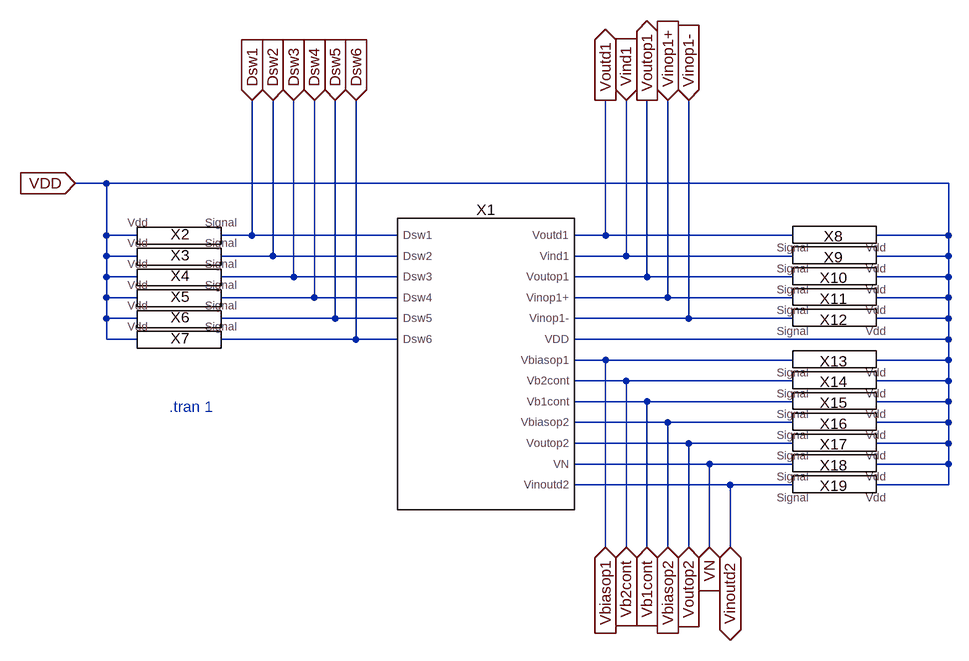
[diagram p0: schematic effectortopESDnew.asc]
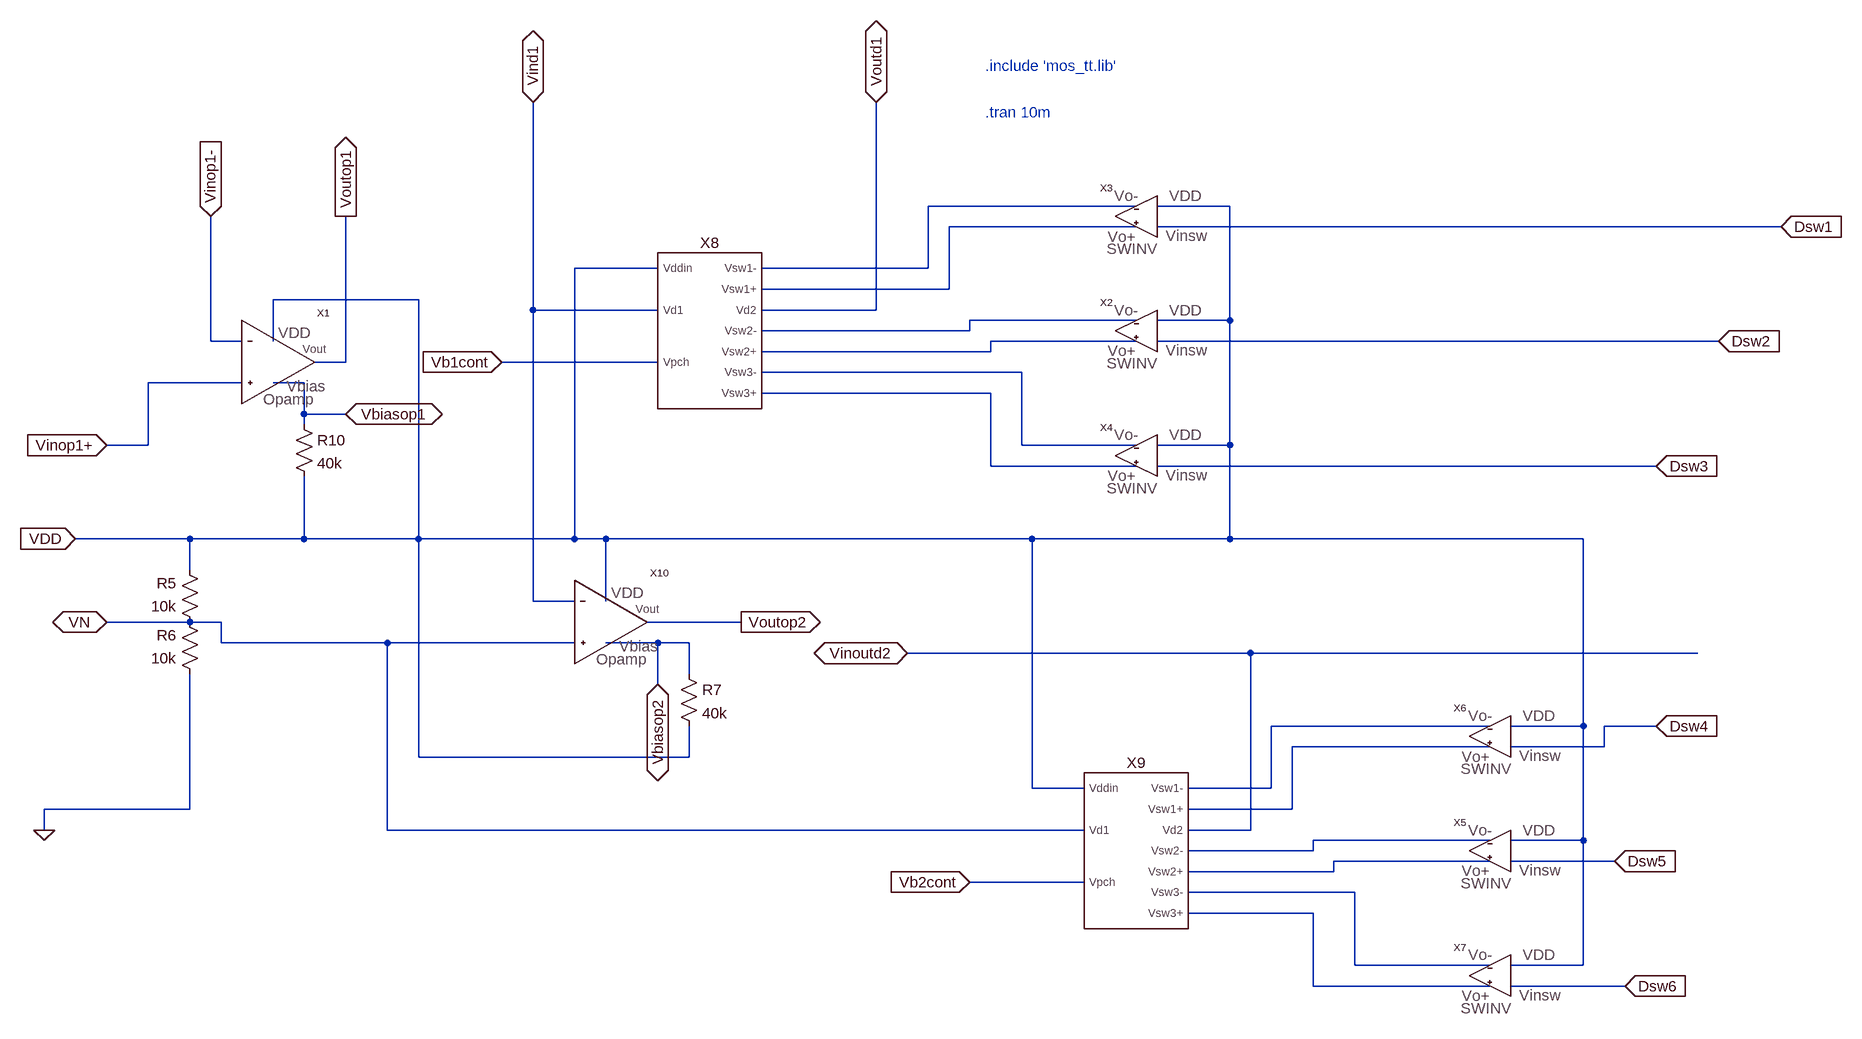
[diagram p1: sub-circuit effectornew.asc]
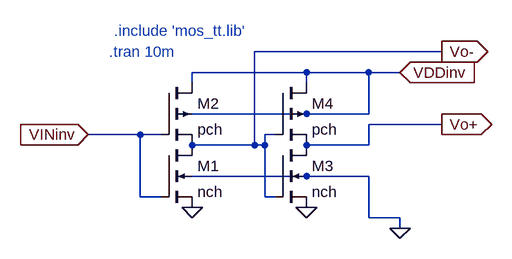
[diagram p2: sub-circuit invsw.asc]
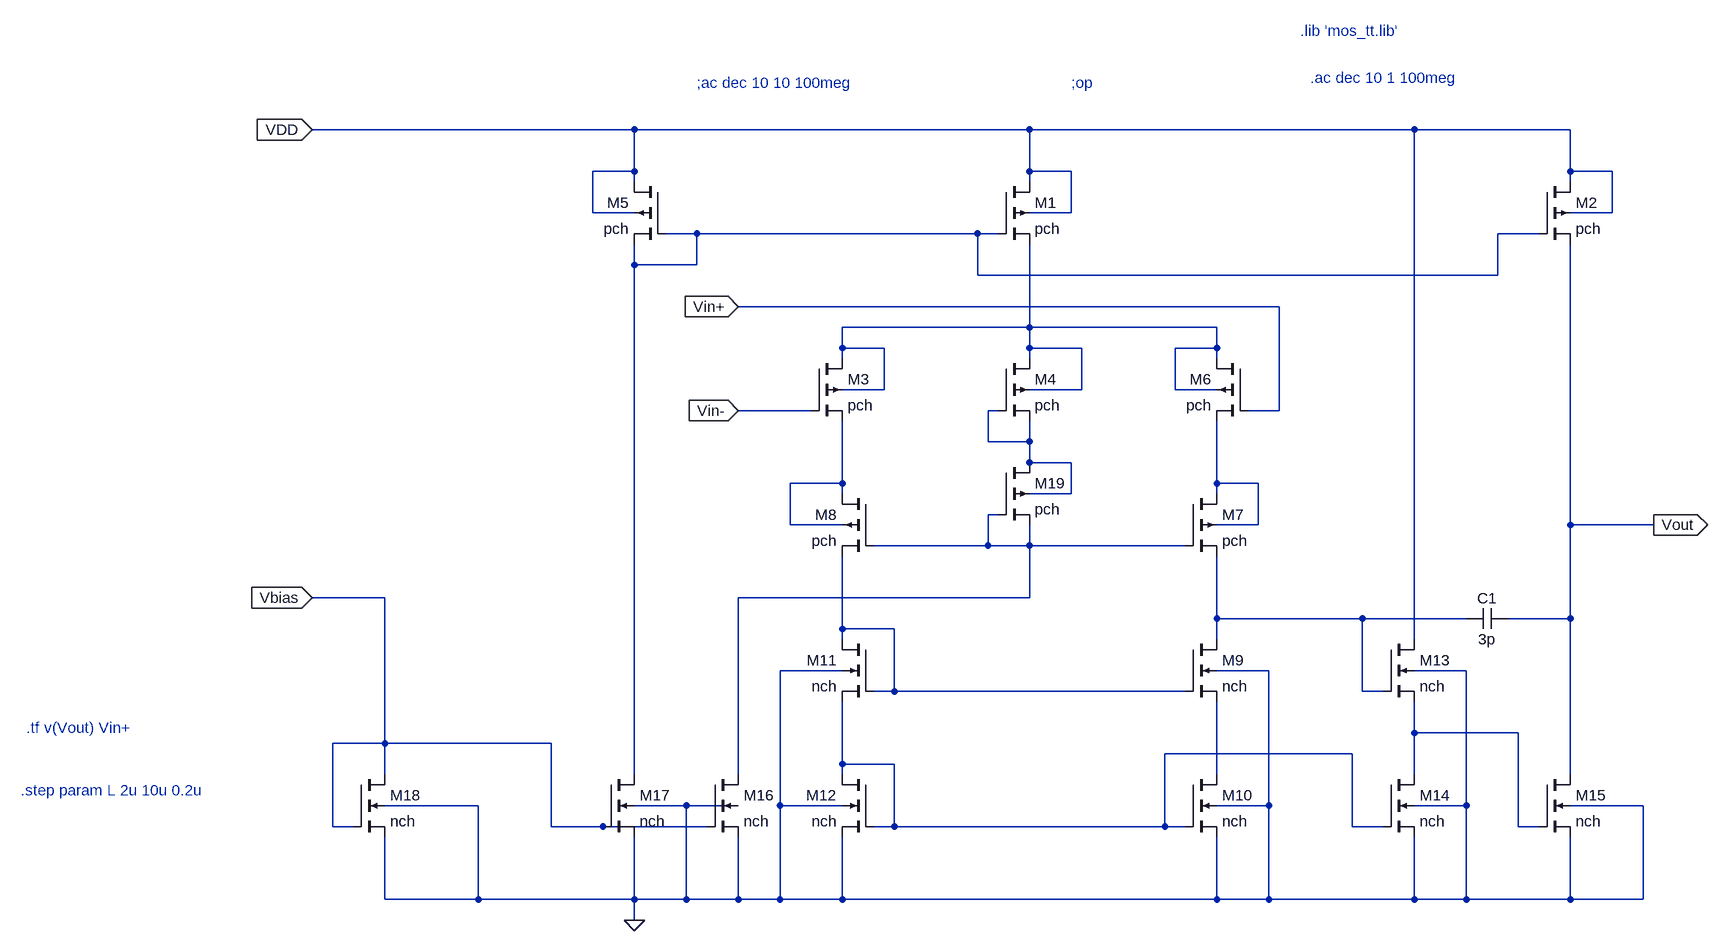
[diagram p3: sub-circuit opamp3u.asc]
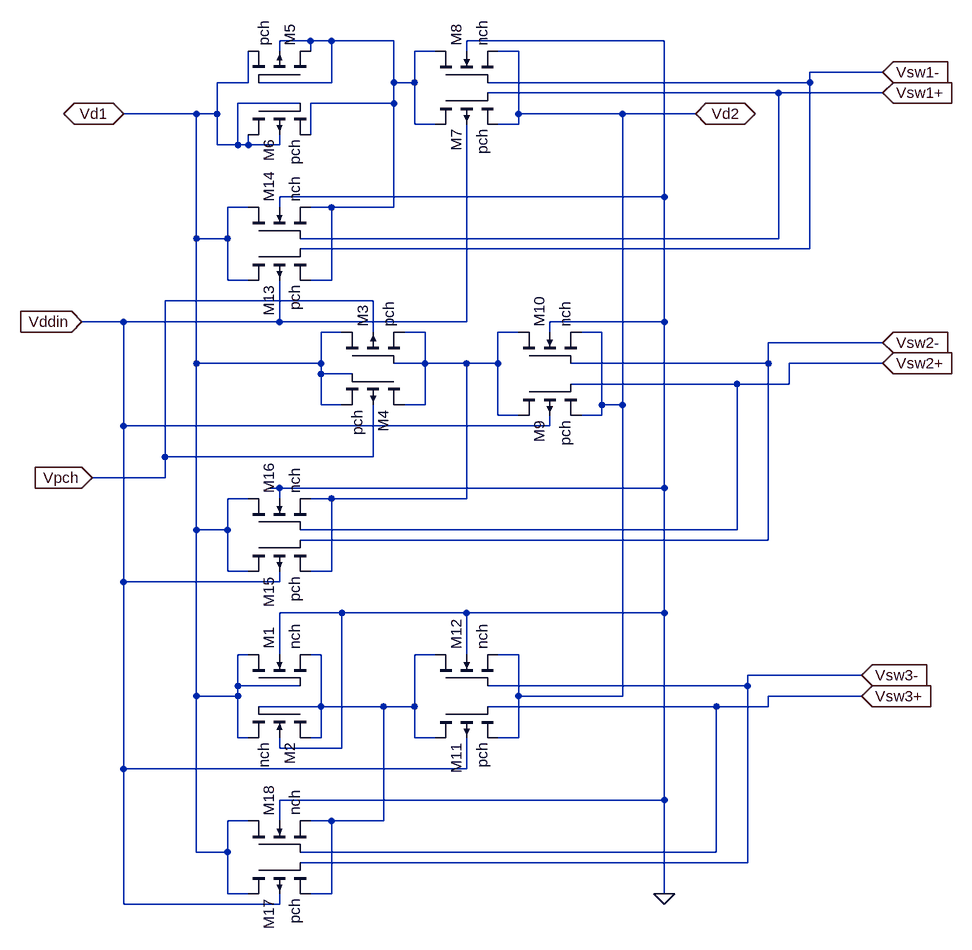
[diagram p4: sub-circuit distotiondevice1esdpchnew.asc]
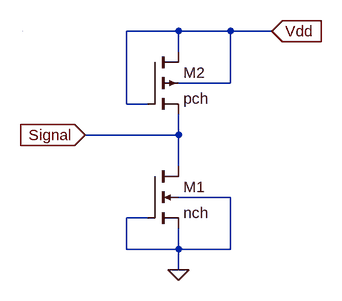
[diagram p5: sub-circuit esd.asc]
effectortopESDnew.asc, the LTspice schematic file:
Version 4
SHEET 1 920 756
WIRE -480 16 -528 16
WIRE 816 16 -480 16
WIRE -480 96 -480 16
WIRE -432 96 -480 96
WIRE -256 96 -256 -112
WIRE -256 96 -304 96
WIRE -32 96 -256 96
WIRE 288 96 288 -112
WIRE 288 96 240 96
WIRE 576 96 288 96
WIRE 816 96 816 16
WIRE 816 96 704 96
WIRE -480 128 -480 96
WIRE -432 128 -480 128
WIRE -224 128 -224 -112
WIRE -224 128 -304 128
WIRE -32 128 -224 128
WIRE 320 128 320 -112
WIRE 320 128 240 128
WIRE 576 128 320 128
WIRE 816 128 816 96
WIRE 816 128 704 128
WIRE -480 160 -480 128
WIRE -432 160 -480 160
WIRE -192 160 -192 -112
WIRE -192 160 -304 160
WIRE -32 160 -192 160
WIRE 352 160 352 -112
WIRE 352 160 240 160
WIRE 576 160 352 160
WIRE 816 160 816 128
WIRE 816 160 704 160
WIRE -480 192 -480 160
WIRE -432 192 -480 192
WIRE -160 192 -160 -112
WIRE -160 192 -304 192
WIRE -32 192 -160 192
WIRE 384 192 384 -112
WIRE 384 192 240 192
WIRE 576 192 384 192
WIRE 816 192 816 160
WIRE 816 192 704 192
WIRE -480 224 -480 192
WIRE -432 224 -480 224
WIRE -128 224 -128 -112
WIRE -128 224 -304 224
WIRE -32 224 -128 224
WIRE 416 224 416 -112
WIRE 416 224 240 224
WIRE 576 224 416 224
WIRE 816 224 816 192
WIRE 816 224 704 224
WIRE -480 256 -480 224
WIRE -432 256 -480 256
WIRE -96 256 -96 -112
WIRE -96 256 -304 256
WIRE -32 256 -96 256
WIRE 816 256 816 224
WIRE 816 256 240 256
WIRE 288 288 240 288
WIRE 576 288 288 288
WIRE 816 288 816 256
WIRE 816 288 704 288
WIRE 320 320 240 320
WIRE 576 320 320 320
WIRE 816 320 816 288
WIRE 816 320 704 320
WIRE 352 352 240 352
WIRE 576 352 352 352
WIRE 816 352 816 320
WIRE 816 352 704 352
WIRE 384 384 240 384
WIRE 576 384 384 384
WIRE 816 384 816 352
WIRE 816 384 704 384
WIRE 416 416 240 416
WIRE 576 416 416 416
WIRE 816 416 816 384
WIRE 816 416 704 416
WIRE 448 448 240 448
WIRE 576 448 448 448
WIRE 816 448 816 416
WIRE 816 448 704 448
WIRE 480 480 240 480
WIRE 576 480 480 480
WIRE 816 480 816 448
WIRE 816 480 704 480
WIRE 288 576 288 288
WIRE 320 576 320 320
WIRE 352 576 352 352
WIRE 384 576 384 384
WIRE 416 576 416 416
WIRE 448 576 448 448
WIRE 480 576 480 480
FLAG -528 16 VDD
IOPIN -528 16 In
FLAG -256 -112 Dsw1
IOPIN -256 -112 In
FLAG -224 -112 Dsw2
IOPIN -224 -112 In
FLAG -192 -112 Dsw3
IOPIN -192 -112 In
FLAG -160 -112 Dsw4
IOPIN -160 -112 In
FLAG -128 -112 Dsw5
IOPIN -128 -112 In
FLAG -96 -112 Dsw6
IOPIN -96 -112 In
FLAG 288 -112 Voutd1
IOPIN 288 -112 Out
FLAG 320 -112 Vind1
IOPIN 320 -112 In
FLAG 352 -112 Voutop1
IOPIN 352 -112 Out
FLAG 384 -112 Vinop1+
IOPIN 384 -112 In
FLAG 416 -112 Vinop1-
IOPIN 416 -112 In
FLAG 288 576 Vbiasop1
IOPIN 288 576 In
FLAG 320 576 Vb2cont
IOPIN 320 576 In
FLAG 384 576 Vbiasop2
IOPIN 384 576 In
FLAG 416 576 Voutop2
IOPIN 416 576 In
FLAG 448 576 VN
IOPIN 448 576 In
FLAG 352 576 Vb1cont
IOPIN 352 576 In
FLAG 480 576 Vinoutd2
IOPIN 480 576 BiDir
SYMBOL effectornew 96 256 R0
SYMATTR InstName X1
SYMBOL ESD -368 96 R0
SYMATTR InstName X2
SYMBOL ESD -368 128 R0
SYMATTR InstName X3
SYMBOL ESD -368 160 R0
SYMATTR InstName X4
SYMBOL ESD -368 192 R0
SYMATTR InstName X5
SYMBOL ESD -368 224 R0
SYMATTR InstName X6
SYMBOL ESD -368 256 R0
SYMATTR InstName X7
SYMBOL ESD 640 96 R180
SYMATTR InstName X8
SYMBOL ESD 640 128 R180
SYMATTR InstName X9
SYMBOL ESD 640 160 R180
SYMATTR InstName X10
SYMBOL ESD 640 192 R180
SYMATTR InstName X11
SYMBOL ESD 640 224 R180
SYMATTR InstName X12
SYMBOL ESD 640 288 R180
SYMATTR InstName X13
SYMBOL ESD 640 320 R180
SYMATTR InstName X14
SYMBOL ESD 640 352 R180
SYMATTR InstName X15
SYMBOL ESD 640 384 R180
SYMATTR InstName X16
SYMBOL ESD 640 416 R180
SYMATTR InstName X17
SYMBOL ESD 640 448 R180
SYMATTR InstName X18
SYMBOL ESD 640 480 R180
SYMATTR InstName X19
TEXT -384 360 Left 2 ;.tran 1

effectornew.asc, the sub-circuit schematic file:
Version 4
SHEET 1 2252 1512
WIRE 1024 128 704 128
WIRE 1168 128 1056 128
WIRE 1024 160 736 160
WIRE 2016 160 1056 160
WIRE 288 224 160 224
WIRE 704 224 704 128
WIRE 704 224 448 224
WIRE 736 256 736 160
WIRE 736 256 448 256
WIRE -80 272 -304 272
WIRE 96 288 96 -32
WIRE 288 288 96 288
WIRE 624 288 624 -32
WIRE 624 288 448 288
WIRE 1024 304 768 304
WIRE 1168 304 1168 128
WIRE 1168 304 1056 304
WIRE 768 320 768 304
WIRE 768 320 448 320
WIRE -400 336 -400 144
WIRE -352 336 -400 336
WIRE -304 336 -304 272
WIRE 1024 336 800 336
WIRE 1920 336 1056 336
WIRE 800 352 800 336
WIRE 800 352 448 352
WIRE -192 368 -192 144
WIRE -192 368 -240 368
WIRE 288 368 48 368
WIRE 848 384 448 384
WIRE -352 400 -496 400
WIRE -256 400 -304 400
WIRE 800 416 448 416
WIRE -256 448 -256 400
WIRE -192 448 -256 448
WIRE -256 464 -256 448
WIRE -496 496 -496 400
WIRE -496 496 -560 496
WIRE 848 496 848 384
WIRE 1024 496 848 496
WIRE 1168 496 1168 304
WIRE 1168 496 1056 496
WIRE 800 528 800 416
WIRE 1024 528 800 528
WIRE 1824 528 1056 528
WIRE -432 640 -608 640
WIRE -256 640 -256 544
WIRE -256 640 -432 640
WIRE -80 640 -80 272
WIRE -80 640 -256 640
WIRE 160 640 160 224
WIRE 160 640 -80 640
WIRE 208 640 160 640
WIRE 864 640 208 640
WIRE 1168 640 1168 496
WIRE 1168 640 864 640
WIRE 1712 640 1168 640
WIRE -432 688 -432 640
WIRE 96 736 96 288
WIRE 160 736 96 736
WIRE 208 736 208 640
WIRE -432 768 -560 768
WIRE -384 768 -432 768
WIRE 416 768 272 768
WIRE -384 800 -384 768
WIRE -128 800 -384 800
WIRE 160 800 -128 800
WIRE 288 800 208 800
WIRE 336 800 288 800
WIRE 1200 816 672 816
WIRE 1888 816 1200 816
WIRE 336 848 336 800
WIRE 288 864 288 800
WIRE 1568 928 1232 928
WIRE 1712 928 1712 640
WIRE 1712 928 1600 928
WIRE 1824 928 1744 928
WIRE 1568 960 1264 960
WIRE 1744 960 1744 928
WIRE 1744 960 1600 960
WIRE -80 976 -80 640
WIRE 336 976 336 928
WIRE 336 976 -80 976
WIRE 864 1024 864 640
WIRE 944 1024 864 1024
WIRE 1232 1024 1232 928
WIRE 1232 1024 1104 1024
WIRE -432 1056 -432 848
WIRE -432 1056 -656 1056
WIRE 1264 1056 1264 960
WIRE 1264 1056 1104 1056
WIRE -656 1088 -656 1056
WIRE -128 1088 -128 800
WIRE 944 1088 -128 1088
WIRE 1200 1088 1200 816
WIRE 1200 1088 1104 1088
WIRE 1568 1104 1296 1104
WIRE 1712 1104 1712 928
WIRE 1712 1104 1600 1104
WIRE 1296 1120 1296 1104
WIRE 1296 1120 1104 1120
WIRE 1568 1136 1328 1136
WIRE 1760 1136 1600 1136
WIRE 1328 1152 1328 1136
WIRE 1328 1152 1104 1152
WIRE 944 1168 768 1168
WIRE 1360 1184 1104 1184
WIRE 1296 1216 1104 1216
WIRE 1360 1296 1360 1184
WIRE 1568 1296 1360 1296
WIRE 1712 1296 1712 1104
WIRE 1712 1296 1600 1296
WIRE 1296 1328 1296 1216
WIRE 1568 1328 1296 1328
WIRE 1776 1328 1600 1328
FLAG -656 1088 0
FLAG -560 768 VN
IOPIN -560 768 BiDir
FLAG 288 864 Vbiasop2
IOPIN 288 864 BiDir
FLAG 672 816 Vinoutd2
IOPIN 672 816 BiDir
FLAG 1776 1328 Dsw6
IOPIN 1776 1328 In
FLAG 1760 1136 Dsw5
IOPIN 1760 1136 In
FLAG 1824 928 Dsw4
IOPIN 1824 928 In
FLAG 1824 528 Dsw3
IOPIN 1824 528 In
FLAG 1920 336 Dsw2
IOPIN 1920 336 In
FLAG 2016 160 Dsw1
IOPIN 2016 160 In
FLAG 416 768 Voutop2
IOPIN 416 768 Out
FLAG 624 -32 Voutd1
IOPIN 624 -32 BiDir
FLAG 96 -32 Vind1
IOPIN 96 -32 BiDir
FLAG 768 1168 Vb2cont
IOPIN 768 1168 In
FLAG 48 368 Vb1cont
IOPIN 48 368 In
FLAG -192 144 Voutop1
IOPIN -192 144 Out
FLAG -192 448 Vbiasop1
IOPIN -192 448 BiDir
FLAG -560 496 Vinop1+
IOPIN -560 496 In
FLAG -608 640 VDD
IOPIN -608 640 In
FLAG -400 144 Vinop1-
IOPIN -400 144 In
SYMBOL res -416 784 R180
WINDOW 0 36 76 Left 2
WINDOW 3 36 40 Left 2
SYMATTR InstName R5
SYMATTR Value 10k
SYMBOL res -416 864 R180
WINDOW 0 36 76 Left 2
WINDOW 3 36 40 Left 2
SYMATTR InstName R6
SYMATTR Value 10k
SYMBOL INVSW 1024 320 M0
SYMATTR InstName X2
SYMBOL INVSW 1024 144 M0
SYMATTR InstName X3
SYMBOL INVSW 1024 512 M0
SYMATTR InstName X4
SYMBOL res 320 832 R0
SYMATTR InstName R7
SYMATTR Value 40k
SYMBOL INVSW 1568 1120 M0
SYMATTR InstName X5
SYMBOL INVSW 1568 944 M0
SYMATTR InstName X6
SYMBOL INVSW 1568 1312 M0
SYMATTR InstName X7
SYMBOL res -272 448 R0
SYMATTR InstName R10
SYMATTR Value 40k
SYMBOL Opamp3u -272 368 R0
SYMATTR InstName X1
SYMBOL Opamp3u 240 768 R0
SYMATTR InstName X10
SYMBOL Distotiondevice1ESDpchnew 368 320 R0
SYMATTR InstName X8
SYMBOL Distotiondevice1ESDpchnew 1024 1120 R0
SYMATTR InstName X9
TEXT 792 -16 Left 2 ;.tran 10m
TEXT 792 -88 Left 2 ;.include 'mos_tt.lib'

invsw.asc, the sub-circuit schematic file:
Version 4
SHEET 1 880 680
WIRE 544 32 256 32
WIRE 336 64 160 64
WIRE 432 64 336 64
WIRE 480 64 432 64
WIRE 160 80 160 64
WIRE 336 80 336 64
WIRE 336 128 160 128
WIRE 432 128 432 64
WIRE 432 128 336 128
WIRE 544 144 432 144
WIRE 80 160 0 160
WIRE 112 160 80 160
WIRE 288 160 272 160
WIRE 256 176 256 32
WIRE 256 176 160 176
WIRE 272 176 272 160
WIRE 272 176 256 176
WIRE 432 176 432 144
WIRE 432 176 336 176
WIRE 336 224 160 224
WIRE 432 224 336 224
WIRE 80 256 80 160
WIRE 112 256 80 256
WIRE 272 256 272 176
WIRE 288 256 272 256
WIRE 432 288 432 224
WIRE 480 288 432 288
WIRE 480 304 480 288
FLAG 480 304 0
FLAG 160 272 0
FLAG 336 272 0
FLAG 544 144 Vo+
IOPIN 544 144 Out
FLAG 544 32 Vo-
IOPIN 544 32 Out
FLAG 480 64 VDDinv
IOPIN 480 64 In
FLAG 0 160 VINinv
IOPIN 0 160 In
SYMBOL nmos4 112 176 R0
SYMATTR InstName M1
SYMATTR Value2 l=2u w=6u ad=4.2e-11 as=4.2e-11 pd=20e-6 ps=20e-6
SYMATTR Value nch
SYMBOL pmos4 112 80 R0
SYMATTR InstName M2
SYMATTR Value2 l=2u w=10u ad=7e-11 as=7e-11 pd=24e-6 ps=24e-6
SYMATTR Value pch
SYMBOL nmos4 288 176 R0
SYMATTR InstName M3
SYMATTR Value2 l=2u w=12u ad=8.4e-11 as=8.4e-11 pd=26e-6 ps=26e-6
SYMATTR Value nch
SYMBOL pmos4 288 80 R0
SYMATTR InstName M4
SYMATTR Value2 l=2u w=20u ad=1.4e-10 as=1.4e-10 pd=34e-6 ps=34e-6
SYMATTR Value pch
TEXT 32 32 Left 2 ;.tran 10m
TEXT 40 0 Left 2 ;.include 'mos_tt.lib'

opamp3u.asc, the sub-circuit schematic file:
Version 4
SHEET 1 1400 868
WIRE -288 -368 -784 -368
WIRE 320 -368 -288 -368
WIRE 912 -368 320 -368
WIRE 1152 -368 912 -368
WIRE -288 -304 -288 -368
WIRE -288 -304 -352 -304
WIRE 320 -304 320 -368
WIRE 384 -304 320 -304
WIRE 1152 -304 1152 -368
WIRE 1216 -304 1152 -304
WIRE -288 -288 -288 -304
WIRE 320 -288 320 -304
WIRE 1152 -288 1152 -304
WIRE -352 -240 -352 -304
WIRE -288 -240 -352 -240
WIRE 384 -240 384 -304
WIRE 384 -240 320 -240
WIRE 1216 -240 1216 -304
WIRE 1216 -240 1152 -240
WIRE -192 -208 -240 -208
WIRE 240 -208 -192 -208
WIRE 272 -208 240 -208
WIRE 1104 -208 1040 -208
WIRE -288 -160 -288 -192
WIRE -192 -160 -192 -208
WIRE -192 -160 -288 -160
WIRE 240 -144 240 -208
WIRE 1040 -144 1040 -208
WIRE 1040 -144 240 -144
WIRE 704 -96 -128 -96
WIRE 320 -64 320 -192
WIRE 320 -64 32 -64
WIRE 608 -64 320 -64
WIRE 32 -32 32 -64
WIRE 96 -32 32 -32
WIRE 320 -32 320 -64
WIRE 400 -32 320 -32
WIRE 608 -32 608 -64
WIRE 608 -32 544 -32
WIRE 32 -16 32 -32
WIRE 320 -16 320 -32
WIRE 608 -16 608 -32
WIRE 96 32 96 -32
WIRE 96 32 32 32
WIRE 400 32 400 -32
WIRE 400 32 320 32
WIRE 544 32 544 -32
WIRE 608 32 544 32
WIRE -16 64 -128 64
WIRE 272 64 256 64
WIRE 704 64 704 -96
WIRE 704 64 656 64
WIRE 256 112 256 64
WIRE 320 112 320 80
WIRE 320 112 256 112
WIRE 320 144 320 112
WIRE 384 144 320 144
WIRE 32 176 32 80
WIRE 32 176 -48 176
WIRE 608 176 608 80
WIRE 672 176 608 176
WIRE 32 192 32 176
WIRE 384 192 384 144
WIRE 384 192 320 192
WIRE 608 192 608 176
WIRE 272 224 256 224
WIRE -48 240 -48 176
WIRE 32 240 -48 240
WIRE 672 240 672 176
WIRE 672 240 608 240
WIRE 1152 240 1152 -192
WIRE 1280 240 1152 240
WIRE 256 272 256 224
WIRE 256 272 80 272
WIRE 320 272 320 240
WIRE 320 272 256 272
WIRE 560 272 320 272
WIRE -672 352 -784 352
WIRE 320 352 320 272
WIRE 320 352 -128 352
WIRE 608 384 608 288
WIRE 832 384 608 384
WIRE 992 384 832 384
WIRE 1152 384 1152 240
WIRE 1152 384 1056 384
WIRE 32 400 32 288
WIRE 112 400 32 400
WIRE 32 416 32 400
WIRE 608 416 608 384
WIRE 912 416 912 -368
WIRE 32 464 -64 464
WIRE 688 464 608 464
WIRE 992 464 912 464
WIRE 112 496 112 400
WIRE 112 496 80 496
WIRE 560 496 112 496
WIRE 832 496 832 384
WIRE 864 496 832 496
WIRE 912 560 912 512
WIRE 1072 560 912 560
WIRE -672 576 -672 352
WIRE -672 576 -752 576
WIRE -416 576 -672 576
WIRE 816 592 528 592
WIRE 32 608 32 512
WIRE 112 608 32 608
WIRE -672 624 -672 576
WIRE -288 624 -288 -160
WIRE -128 624 -128 352
WIRE 32 624 32 608
WIRE 608 624 608 512
WIRE 912 624 912 560
WIRE 1152 624 1152 384
WIRE -528 672 -672 672
WIRE -208 672 -288 672
WIRE -128 672 -208 672
WIRE -64 672 -64 464
WIRE 32 672 -64 672
WIRE 688 672 688 464
WIRE 688 672 608 672
WIRE 992 672 992 464
WIRE 992 672 912 672
WIRE 1264 672 1152 672
WIRE -752 704 -752 576
WIRE -720 704 -752 704
WIRE -416 704 -416 576
WIRE -336 704 -416 704
WIRE -176 704 -336 704
WIRE 112 704 112 608
WIRE 112 704 80 704
WIRE 528 704 528 592
WIRE 528 704 112 704
WIRE 560 704 528 704
WIRE 816 704 816 592
WIRE 864 704 816 704
WIRE 1072 704 1072 560
WIRE 1104 704 1072 704
WIRE -672 816 -672 720
WIRE -528 816 -528 672
WIRE -528 816 -672 816
WIRE -288 816 -288 720
WIRE -288 816 -528 816
WIRE -208 816 -208 672
WIRE -208 816 -288 816
WIRE -128 816 -128 720
WIRE -128 816 -208 816
WIRE -64 816 -64 672
WIRE -64 816 -128 816
WIRE 32 816 32 720
WIRE 32 816 -64 816
WIRE 608 816 608 720
WIRE 608 816 32 816
WIRE 688 816 688 672
WIRE 688 816 608 816
WIRE 912 816 912 720
WIRE 912 816 688 816
WIRE 992 816 992 672
WIRE 992 816 912 816
WIRE 1152 816 1152 720
WIRE 1152 816 992 816
WIRE 1264 816 1264 672
WIRE 1264 816 1152 816
WIRE -288 848 -288 816
FLAG -288 848 0
FLAG -128 64 Vin-
IOPIN -128 64 In
FLAG -128 -96 Vin+
IOPIN -128 -96 In
FLAG -784 -368 VDD
IOPIN -784 -368 In
FLAG 1280 240 Vout
IOPIN 1280 240 Out
FLAG -784 352 Vbias
IOPIN -784 352 In
SYMBOL pmos4 272 -288 R0
SYMATTR InstName M1
SYMATTR Value pch
SYMATTR Value2 l=3u w=150u ad=1.05e-9 as=1.05e-9 pd=164e-6 ps=164e-6
SYMBOL pmos4 1104 -288 R0
SYMATTR InstName M2
SYMATTR Value pch
SYMATTR Value2 l=3u w=150u ad=1.05e-9 as=1.05e-9 pd=164e-6 ps=164e-6 m=2
SYMBOL pmos4 -16 -16 R0
SYMATTR InstName M3
SYMATTR Value pch
SYMATTR Value2 l=3u w=75u ad=5.25e-10 as=5.25e-10 pd=89e-6 ps=89e-6
SYMBOL pmos4 272 -16 R0
SYMATTR InstName M4
SYMATTR Value pch
SYMATTR Value2 l=2u w=75u ad=5.25e-10 as=5.25e-10 pd=89e-6 ps=89e-6
SYMBOL pmos4 -240 -288 M0
SYMATTR InstName M5
SYMATTR Value pch
SYMATTR Value2 l=3u w=150u ad=1.05e-9 as=1.05e-9 pd=164e-6 ps=164e-6
SYMBOL pmos4 656 -16 M0
SYMATTR InstName M6
SYMATTR Value pch
SYMATTR Value2 l=3u w=75u ad=5.25e-10 as=5.25e-10 pd=89e-6 ps=89e-6
SYMBOL pmos4 560 192 R0
SYMATTR InstName M7
SYMATTR Value pch
SYMATTR Value2 l=4u w=75u ad=5.25e-10 as=5.25e-10 pd=89e-6 ps=89e-6
SYMBOL pmos4 80 192 M0
SYMATTR InstName M8
SYMATTR Value pch
SYMATTR Value2 l=4u w=75u ad=5.25e-10 as=5.25e-10 pd=89e-6 ps=89e-6
SYMBOL nmos4 560 416 R0
SYMATTR InstName M9
SYMATTR Value nch
SYMATTR Value2 l=3u w=50u ad=3.5e-10 as=3.5e-10 pd=64e-6 ps=64e-6
SYMBOL nmos4 560 624 R0
SYMATTR InstName M10
SYMATTR Value nch
SYMATTR Value2 l=3u w=50u ad=3.5e-10 as=3.5e-10 pd=64e-6 ps=64e-6
SYMBOL nmos4 80 416 M0
SYMATTR InstName M11
SYMATTR Value nch
SYMATTR Value2 l=3u w=50u ad=3.5e-10 as=3.5e-10 pd=64e-6 ps=64e-6
SYMBOL nmos4 80 624 M0
SYMATTR InstName M12
SYMATTR Value nch
SYMATTR Value2 l=3u w=50u ad=3.5e-10 as=3.5e-10 pd=64e-6 ps=64e-6
SYMBOL nmos4 864 416 R0
SYMATTR InstName M13
SYMATTR Value nch
SYMATTR Value2 l=3u w=50u ad=3.5e-10 as=3.5e-10 pd=64e-6 ps=64e-6
SYMBOL nmos4 864 624 R0
SYMATTR InstName M14
SYMATTR Value nch
SYMATTR Value2 l=3u w=50u ad=3.5e-10 as=3.5e-10 pd=64e-6 ps=64e-6
SYMBOL nmos4 1104 624 R0
SYMATTR InstName M15
SYMATTR Value nch
SYMATTR Value2 l=3u w=300u ad=2.1e-9 as=2.1e-9 pd=314e-6 ps=314e-6
SYMBOL cap 992 400 R270
WINDOW 0 32 32 VTop 2
WINDOW 3 0 32 VBottom 2
SYMATTR InstName C1
SYMATTR Value 3p
SYMBOL nmos4 -176 624 R0
SYMATTR InstName M16
SYMATTR Value nch
SYMATTR Value2 l=3u w=50u ad=3.5e-10 as=3.5e-10 pd=64e-6 ps=64e-6
SYMBOL nmos4 -336 624 R0
SYMATTR InstName M17
SYMATTR Value nch
SYMATTR Value2 l=3u w=100u ad=7e-10 as=7e-10 pd=114e-6 ps=114e-6
SYMBOL nmos4 -720 624 R0
SYMATTR InstName M18
SYMATTR Value nch
SYMATTR Value2 l=3u w=100u ad=7e-10 as=7e-10 pd=114e-6 ps=114e-6
SYMBOL pmos4 272 144 R0
SYMATTR InstName M19
SYMATTR Value2 l=2u w=75u ad=5.25e-10 as=5.25e-10 pd=89e-6 ps=89e-6
SYMATTR Value pch
TEXT 752 -448 Left 2 ;.ac dec 10 1 100meg
TEXT 736 -520 Left 2 ;.lib 'mos_tt.lib'
TEXT 384 -440 Left 2 ;;op
TEXT -192 -440 Left 2 ;;ac dec 10 10 100meg
TEXT -1224 552 Left 2 ;.tf v(Vout) Vin+
TEXT -1232 648 Left 2 ;.step param L 2u 10u 0.2u

distotiondevice1esdpchnew.asc, the sub-circuit schematic file:
Version 4
SHEET 1 2252 1512
WIRE 144 -160 96 -160
WIRE 176 -160 144 -160
WIRE 272 -160 176 -160
WIRE 688 -160 384 -160
WIRE 96 -144 96 -160
WIRE 144 -144 144 -160
WIRE 336 -144 304 -144
WIRE 384 -144 384 -160
WIRE 464 -144 432 -144
WIRE 1024 -112 912 -112
WIRE 48 -96 48 -144
WIRE 48 -96 0 -96
WIRE 176 -96 176 -160
WIRE 176 -96 64 -96
WIRE 272 -96 272 -160
WIRE 304 -96 304 -144
WIRE 304 -96 272 -96
WIRE 912 -96 912 -112
WIRE 912 -96 416 -96
WIRE 864 -80 416 -80
WIRE 1024 -80 864 -80
WIRE 128 -64 32 -64
WIRE 272 -64 272 -96
WIRE 272 -64 144 -64
WIRE -32 -48 -144 -48
WIRE 0 -48 0 -96
WIRE 0 -48 -32 -48
WIRE 464 -48 464 -144
WIRE 624 -48 464 -48
WIRE 736 -48 624 -48
WIRE 304 -32 304 -96
WIRE 336 -32 304 -32
WIRE 464 -32 464 -48
WIRE 464 -32 432 -32
WIRE 144 -16 144 -64
WIRE 0 0 0 -48
WIRE 32 0 32 -64
WIRE 32 0 0 0
WIRE 48 0 48 -16
WIRE 48 0 32 0
WIRE 96 0 96 -16
WIRE 96 0 48 0
WIRE 688 80 688 -160
WIRE 688 80 96 80
WIRE 48 96 16 96
WIRE 96 96 96 80
WIRE 176 96 144 96
WIRE 272 96 272 -64
WIRE 272 96 176 96
WIRE -32 144 -32 -48
WIRE 16 144 16 96
WIRE 16 144 -32 144
WIRE 864 144 864 -80
WIRE 864 144 128 144
WIRE 912 160 912 -96
WIRE 912 160 128 160
WIRE 16 208 16 144
WIRE 48 208 16 208
WIRE 176 208 176 96
WIRE 176 208 144 208
WIRE 240 240 -80 240
WIRE -144 272 -208 272
WIRE 96 272 96 208
WIRE 96 272 -144 272
WIRE 384 272 384 -32
WIRE 384 272 96 272
WIRE 688 272 688 80
WIRE 688 272 512 272
WIRE 192 288 160 288
WIRE 240 288 240 240
WIRE 320 288 288 288
WIRE 464 288 432 288
WIRE 512 288 512 272
WIRE 592 288 560 288
WIRE 1024 304 848 304
WIRE -32 336 -32 144
WIRE 160 336 160 288
WIRE 160 336 -32 336
WIRE 320 336 320 288
WIRE 320 336 272 336
WIRE 384 336 320 336
WIRE 432 336 432 288
WIRE 432 336 384 336
WIRE 848 336 848 304
WIRE 848 336 544 336
WIRE 1024 336 880 336
WIRE 160 352 160 336
WIRE 208 352 160 352
WIRE 800 368 544 368
WIRE 880 368 880 336
WIRE 880 368 800 368
WIRE 160 400 160 352
WIRE 192 400 160 400
WIRE 320 400 320 336
WIRE 320 400 288 400
WIRE 592 400 592 288
WIRE 624 400 624 -48
WIRE 624 400 592 400
WIRE 432 416 432 336
WIRE 464 416 432 416
WIRE 592 416 592 400
WIRE 592 416 560 416
WIRE -144 432 -144 272
WIRE 512 432 512 416
WIRE 512 432 -144 432
WIRE -80 480 -80 240
WIRE 240 480 240 400
WIRE 240 480 -80 480
WIRE -80 512 -80 480
WIRE -80 512 -192 512
WIRE 96 528 80 528
WIRE 688 528 688 272
WIRE 688 528 96 528
WIRE 48 544 16 544
WIRE 96 544 96 528
WIRE 176 544 144 544
WIRE 384 544 384 336
WIRE 384 544 176 544
WIRE -32 592 -32 336
WIRE 16 592 16 544
WIRE 16 592 -32 592
WIRE 800 592 800 368
WIRE 800 592 128 592
WIRE 848 608 848 336
WIRE 848 608 128 608
WIRE 16 656 16 592
WIRE 48 656 16 656
WIRE 176 656 176 544
WIRE 176 656 144 656
WIRE -144 672 -144 432
WIRE 96 672 96 656
WIRE 96 672 -144 672
WIRE 192 720 96 720
WIRE 384 720 192 720
WIRE 688 720 688 528
WIRE 688 720 384 720
WIRE 48 784 32 784
WIRE 96 784 96 720
WIRE 160 784 144 784
WIRE 336 784 304 784
WIRE 384 784 384 720
WIRE 464 784 432 784
WIRE 992 816 816 816
WIRE 32 832 32 784
WIRE 128 832 32 832
WIRE 816 832 816 816
WIRE 816 832 416 832
WIRE -32 848 -32 592
WIRE 32 848 32 832
WIRE 32 848 -32 848
WIRE 464 848 464 784
WIRE 624 848 624 400
WIRE 624 848 464 848
WIRE 992 848 848 848
WIRE 160 864 160 784
WIRE 160 864 64 864
WIRE 256 864 160 864
WIRE 304 864 304 784
WIRE 304 864 256 864
WIRE 768 864 416 864
WIRE 848 864 848 848
WIRE 848 864 768 864
WIRE 32 912 32 848
WIRE 48 912 32 912
WIRE 160 912 160 864
WIRE 160 912 144 912
WIRE 304 912 304 864
WIRE 336 912 304 912
WIRE 464 912 464 848
WIRE 464 912 432 912
WIRE 96 928 96 912
WIRE 192 928 192 720
WIRE 192 928 96 928
WIRE -144 960 -144 672
WIRE 384 960 384 912
WIRE 384 960 -144 960
WIRE 688 1008 688 720
WIRE 688 1008 96 1008
WIRE 48 1040 16 1040
WIRE 96 1040 96 1008
WIRE 176 1040 144 1040
WIRE 256 1040 256 864
WIRE 256 1040 176 1040
WIRE -32 1088 -32 848
WIRE 16 1088 16 1040
WIRE 16 1088 -32 1088
WIRE 768 1088 768 864
WIRE 768 1088 128 1088
WIRE 816 1104 816 832
WIRE 816 1104 128 1104
WIRE 16 1152 16 1088
WIRE 48 1152 16 1152
WIRE 176 1152 176 1040
WIRE 176 1152 144 1152
WIRE 688 1152 688 1008
WIRE -144 1168 -144 960
WIRE 96 1168 96 1152
WIRE 96 1168 -144 1168
FLAG -144 -48 Vd1
IOPIN -144 -48 BiDir
FLAG -208 272 Vddin
IOPIN -208 272 In
FLAG 736 -48 Vd2
IOPIN 736 -48 BiDir
FLAG 688 1152 0
FLAG 1024 -112 Vsw1-
IOPIN 1024 -112 In
FLAG 1024 -80 Vsw1+
IOPIN 1024 -80 In
FLAG 1024 304 Vsw2-
IOPIN 1024 304 In
FLAG 992 816 Vsw3-
IOPIN 992 816 In
FLAG 1024 336 Vsw2+
IOPIN 1024 336 In
FLAG 992 848 Vsw3+
IOPIN 992 848 In
FLAG -192 512 Vpch
IOPIN -192 512 In
SYMBOL nmos4 48 832 R270
SYMATTR InstName M1
SYMATTR Value2 l=2u w=200u ad=1.4e-9 as=1.4e-9 pd=214e-6 ps=214e-6
SYMATTR Value nch
SYMBOL nmos4 144 864 R90
SYMATTR InstName M2
SYMATTR Value2 l=2u w=200u ad=1.4e-9 as=1.4e-9 pd=214e-6 ps=214e-6
SYMATTR Value nch
SYMBOL pmos4 192 336 R270
SYMATTR InstName M3
SYMATTR Value2 l=2u w=150u ad=1.05e-9 as=1.05e-9 pd=164e-6 ps=164e-6
SYMATTR Value pch
SYMBOL pmos4 288 352 R90
SYMATTR InstName M4
SYMATTR Value2 l=2u w=150u ad=1.05e-9 as=1.05e-9 pd=164e-6 ps=164e-6
SYMATTR Value pch
SYMBOL pmos4 336 -80 M90
SYMATTR InstName M7
SYMATTR Value2 l=2u w=150u ad=1.05e-9 as=1.05e-9 pd=164e-6 ps=164e-6
SYMATTR Value pch
SYMBOL pmos4 144 -96 M270
SYMATTR InstName M5
SYMATTR Value2 l=2u w=100u ad=7e-10 as=7e-10 pd=114e-6 ps=114e-6
SYMATTR Value pch
SYMBOL pmos4 48 -64 M90
SYMATTR InstName M6
SYMATTR Value2 l=2u w=100u ad=7e-10 as=7e-10 pd=114e-6 ps=114e-6
SYMATTR Value pch
SYMBOL nmos4 336 -96 R270
SYMATTR InstName M8
SYMATTR Value2 l=2u w=150u ad=1.05e-9 as=1.05e-9 pd=164e-6 ps=164e-6
SYMATTR Value nch
SYMBOL pmos4 464 368 M90
SYMATTR InstName M9
SYMATTR Value2 l=2u w=150u ad=1.05e-9 as=1.05e-9 pd=164e-6 ps=164e-6
SYMATTR Value pch
SYMBOL nmos4 464 336 R270
SYMATTR InstName M10
SYMATTR Value2 l=2u w=150u ad=1.05e-9 as=1.05e-9 pd=164e-6 ps=164e-6
SYMATTR Value nch
SYMBOL pmos4 336 864 M90
SYMATTR InstName M11
SYMATTR Value2 l=2u w=150u ad=1.05e-9 as=1.05e-9 pd=164e-6 ps=164e-6
SYMATTR Value pch
SYMBOL nmos4 336 832 R270
SYMATTR InstName M12
SYMATTR Value2 l=2u w=150u ad=1.05e-9 as=1.05e-9 pd=164e-6 ps=164e-6
SYMATTR Value nch
SYMBOL pmos4 48 160 M90
SYMATTR InstName M13
SYMATTR Value2 l=2u w=10u ad=7e-11 as=7e-11 pd=24u ps=24u
SYMATTR Value pch
SYMBOL nmos4 48 144 R270
SYMATTR InstName M14
SYMATTR Value2 l=2u w=6u ad=4.2e-11 as=4.2e-11 pd=20u ps=20u
SYMATTR Value nch
SYMBOL pmos4 48 608 M90
SYMATTR InstName M15
SYMATTR Value2 l=2u w=10u ad=7e-11 as=7e-11 pd=24u ps=24u
SYMATTR Value pch
SYMBOL nmos4 48 592 R270
SYMATTR InstName M16
SYMATTR Value2 l=2u w=6u ad=4.2e-11 as=4.2e-11 pd=20u ps=20u
SYMATTR Value nch
SYMBOL pmos4 48 1104 M90
SYMATTR InstName M17
SYMATTR Value2 l=2u w=10u ad=7e-11 as=7e-11 pd=24u ps=24u
SYMATTR Value pch
SYMBOL nmos4 48 1088 R270
SYMATTR InstName M18
SYMATTR Value2 l=2u w=6u ad=4.2e-11 as=4.2e-11 pd=20u ps=20u
SYMATTR Value nch

esd.asc, the sub-circuit schematic file:
Version 4
SHEET 1 880 680
WIRE 240 0 160 0
WIRE 320 0 240 0
WIRE 384 0 320 0
WIRE 240 32 240 0
WIRE 320 80 320 0
WIRE 320 80 240 80
WIRE 160 112 160 0
WIRE 192 112 160 112
WIRE 240 160 240 128
WIRE 240 160 96 160
WIRE 240 208 240 160
WIRE 320 256 240 256
WIRE 192 288 160 288
WIRE 160 336 160 288
WIRE 240 336 240 304
WIRE 240 336 160 336
WIRE 320 336 320 256
WIRE 320 336 240 336
WIRE 240 368 240 336
WIRE 0 0 0 0
FLAG 384 0 Vdd
IOPIN 384 0 In
FLAG 96 160 Signal
IOPIN 96 160 In
FLAG 240 368 0
SYMBOL nmos4 192 208 R0
SYMATTR InstName M1
SYMATTR Value nch
SYMATTR Value2 l=6u w=48u ad={8u*48u} as={8u*48u} pd={16u+48u} ps={16u+48u}
SYMBOL pmos4 192 32 R0
SYMATTR InstName M2
SYMATTR Value pch
SYMATTR Value2 l=6u w=48u ad={8u*48u} as={8u*48u} pd={16u+48u} ps={16u+48u}

The netlist it stands for:
* effectortopESDnew.asc
XX1 Dsw1 Dsw2 Dsw3 Dsw4 Dsw5 Dsw6 VDD Vinop1+ Vinop1- Vb2cont Vb1cont Vbiasop1 Vbiasop2 Vind1 Vinoutd2 VN Voutd1 Voutop1 Voutop2 effectornew
XX2 Dsw1 VDD esd
XX3 Dsw2 VDD esd
XX4 Dsw3 VDD esd
XX5 Dsw4 VDD esd
XX6 Dsw5 VDD esd
XX7 Dsw6 VDD esd
XX8 Voutd1 VDD esd
XX9 Vind1 VDD esd
XX10 Voutop1 VDD esd
XX11 Vinop1+ VDD esd
XX12 Vinop1- VDD esd
XX13 Vbiasop1 VDD esd
XX14 Vb2cont VDD esd
XX15 Vb1cont VDD esd
XX16 Vbiasop2 VDD esd
XX17 Voutop2 VDD esd
XX18 VN VDD esd
XX19 Vinoutd2 VDD esd

* block symbol definitions
.subckt effectornew Dsw1 Dsw2 Dsw3 Dsw4 Dsw5 Dsw6 VDD Vinop1+ Vinop1- Vb2cont Vb1cont Vbiasop1 Vbiasop2 Vind1 Vinoutd2 VN Voutd1 Voutop1 Voutop2
R5 VN VDD 10k
R6 0 VN 10k
XX2 Dsw2 VDD N003 N004 invsw
XX3 Dsw1 VDD N001 N002 invsw
XX4 Dsw3 VDD N005 N006 invsw
R7 Vbiasop2 VDD 40k
XX5 Dsw5 VDD N009 N010 invsw
XX6 Dsw4 VDD N007 N008 invsw
XX7 Dsw6 VDD N011 N012 invsw
R10 Vbiasop1 VDD 40k
XX1 Vinop1- Vinop1+ Voutop1 VDD Vbiasop1 opamp3u
XX10 Vind1 VN Voutop2 VDD Vbiasop2 opamp3u
XX8 VDD N002 N001 N004 N003 N006 N005 Vind1 Voutd1 Vb1cont distotiondevice1esdpchnew
XX9 VDD N008 N007 N010 N009 N012 N011 VN Vinoutd2 Vb2cont distotiondevice1esdpchnew
* .tran 10m
* .include 'mos_tt.lib'
.ends effectornew

.subckt invsw VINinv VDDinv Vo- Vo+
M1 Vo- VINinv 0 0 nch l=2u w=6u ad=4.2e-11 as=4.2e-11 pd=20e-6 ps=20e-6
M2 VDDinv VINinv Vo- VDDinv pch l=2u w=10u ad=7e-11 as=7e-11 pd=24e-6 ps=24e-6
M3 Vo+ Vo- 0 0 nch l=2u w=12u ad=8.4e-11 as=8.4e-11 pd=26e-6 ps=26e-6
M4 VDDinv Vo- Vo+ VDDinv pch l=2u w=20u ad=1.4e-10 as=1.4e-10 pd=34e-6 ps=34e-6
* .tran 10m
* .include 'mos_tt.lib'
.ends invsw

.subckt opamp3u Vin- Vin+ Vout VDD Vbias
M1 VDD N001 N002 VDD pch l=3u w=150u ad=1.05e-9 as=1.05e-9 pd=164e-6 ps=164e-6
M2 VDD N001 Vout VDD pch l=3u w=150u ad=1.05e-9 as=1.05e-9 pd=164e-6 ps=164e-6 m=2
M3 N002 Vin- N004 N002 pch l=3u w=75u ad=5.25e-10 as=5.25e-10 pd=89e-6 ps=89e-6
M4 N002 N003 N003 N002 pch l=2u w=75u ad=5.25e-10 as=5.25e-10 pd=89e-6 ps=89e-6
M5 VDD N001 N001 VDD pch l=3u w=150u ad=1.05e-9 as=1.05e-9 pd=164e-6 ps=164e-6
M6 N002 Vin+ N005 N002 pch l=3u w=75u ad=5.25e-10 as=5.25e-10 pd=89e-6 ps=89e-6
M7 N005 N006 N007 N005 pch l=4u w=75u ad=5.25e-10 as=5.25e-10 pd=89e-6 ps=89e-6
M8 N004 N006 N008 N004 pch l=4u w=75u ad=5.25e-10 as=5.25e-10 pd=89e-6 ps=89e-6
M9 N007 N008 N011 0 nch l=3u w=50u ad=3.5e-10 as=3.5e-10 pd=64e-6 ps=64e-6
M10 N011 N010 0 0 nch l=3u w=50u ad=3.5e-10 as=3.5e-10 pd=64e-6 ps=64e-6
M11 N008 N008 N010 0 nch l=3u w=50u ad=3.5e-10 as=3.5e-10 pd=64e-6 ps=64e-6
M12 N010 N010 0 0 nch l=3u w=50u ad=3.5e-10 as=3.5e-10 pd=64e-6 ps=64e-6
M13 VDD N007 N009 0 nch l=3u w=50u ad=3.5e-10 as=3.5e-10 pd=64e-6 ps=64e-6
M14 N009 N010 0 0 nch l=3u w=50u ad=3.5e-10 as=3.5e-10 pd=64e-6 ps=64e-6
M15 Vout N009 0 0 nch l=3u w=300u ad=2.1e-9 as=2.1e-9 pd=314e-6 ps=314e-6
C1 N007 Vout 3p
M16 N006 Vbias 0 0 nch l=3u w=50u ad=3.5e-10 as=3.5e-10 pd=64e-6 ps=64e-6
M17 N001 Vbias 0 0 nch l=3u w=100u ad=7e-10 as=7e-10 pd=114e-6 ps=114e-6
M18 Vbias Vbias 0 0 nch l=3u w=100u ad=7e-10 as=7e-10 pd=114e-6 ps=114e-6
M19 N003 N006 N006 N003 pch l=2u w=75u ad=5.25e-10 as=5.25e-10 pd=89e-6 ps=89e-6
* .ac dec 10 1 100meg
* .lib 'mos_tt.lib'
* ;op
* ;ac dec 10 10 100meg
* .tf v(Vout) Vin+
* .step param L 2u 10u 0.2u
.ends opamp3u

.subckt distotiondevice1esdpchnew Vddin Vsw1+ Vsw1- Vsw2+ Vsw2- Vsw3+ Vsw3- Vd1 Vd2 Vpch
M1 Vd1 Vd1 N003 0 nch l=2u w=200u ad=1.4e-9 as=1.4e-9 pd=214e-6 ps=214e-6
M2 N003 N003 Vd1 0 nch l=2u w=200u ad=1.4e-9 as=1.4e-9 pd=214e-6 ps=214e-6
M3 Vd1 N002 N002 Vpch pch l=2u w=150u ad=1.05e-9 as=1.05e-9 pd=164e-6 ps=164e-6
M4 N002 Vd1 Vd1 Vpch pch l=2u w=150u ad=1.05e-9 as=1.05e-9 pd=164e-6 ps=164e-6
M7 N001 Vsw1+ Vd2 Vddin pch l=2u w=150u ad=1.05e-9 as=1.05e-9 pd=164e-6 ps=164e-6
M5 N001 N001 Vd1 N001 pch l=2u w=100u ad=7e-10 as=7e-10 pd=114e-6 ps=114e-6
M6 Vd1 Vd1 N001 Vd1 pch l=2u w=100u ad=7e-10 as=7e-10 pd=114e-6 ps=114e-6
M8 N001 Vsw1- Vd2 0 nch l=2u w=150u ad=1.05e-9 as=1.05e-9 pd=164e-6 ps=164e-6
M9 N002 Vsw2+ Vd2 Vddin pch l=2u w=150u ad=1.05e-9 as=1.05e-9 pd=164e-6 ps=164e-6
M10 N002 Vsw2- Vd2 0 nch l=2u w=150u ad=1.05e-9 as=1.05e-9 pd=164e-6 ps=164e-6
M11 N003 Vsw3+ Vd2 Vddin pch l=2u w=150u ad=1.05e-9 as=1.05e-9 pd=164e-6 ps=164e-6
M12 N003 Vsw3- Vd2 0 nch l=2u w=150u ad=1.05e-9 as=1.05e-9 pd=164e-6 ps=164e-6
M13 Vd1 Vsw1- N001 Vddin pch l=2u w=10u ad=7e-11 as=7e-11 pd=24u ps=24u
M14 Vd1 Vsw1+ N001 0 nch l=2u w=6u ad=4.2e-11 as=4.2e-11 pd=20u ps=20u
M15 Vd1 Vsw2- N002 Vddin pch l=2u w=10u ad=7e-11 as=7e-11 pd=24u ps=24u
M16 Vd1 Vsw2+ N002 0 nch l=2u w=6u ad=4.2e-11 as=4.2e-11 pd=20u ps=20u
M17 Vd1 Vsw3- N003 Vddin pch l=2u w=10u ad=7e-11 as=7e-11 pd=24u ps=24u
M18 Vd1 Vsw3+ N003 0 nch l=2u w=6u ad=4.2e-11 as=4.2e-11 pd=20u ps=20u
.ends distotiondevice1esdpchnew

.subckt esd Signal Vdd
M1 Signal 0 0 0 nch l=6u w=48u ad={8u*48u} as={8u*48u} pd={16u+48u} ps={16u+48u}
M2 Vdd Vdd Signal Vdd pch l=6u w=48u ad={8u*48u} as={8u*48u} pd={16u+48u} ps={16u+48u}
.ends esd

.model NMOS NMOS
.model PMOS PMOS
.lib standard.mos
* .tran 1
.backanno
.end